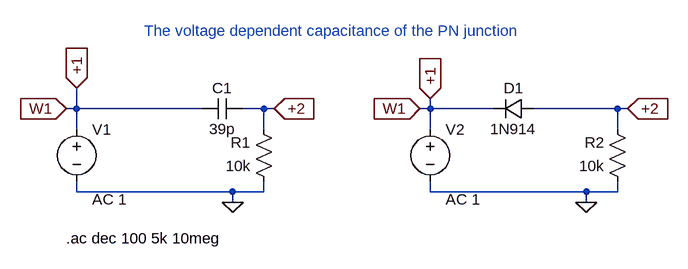
[diagram p0: schematic v_dep_pn_ltspice.asc]
v_dep_pn_ltspice.asc, the LTspice schematic file:
Version 4
SHEET 1 880 680
WIRE -160 112 -160 80
WIRE -160 112 -176 112
WIRE 32 112 -160 112
WIRE 128 112 96 112
WIRE 144 112 128 112
WIRE 384 112 384 96
WIRE 384 112 368 112
WIRE 480 112 384 112
WIRE 672 112 544 112
WIRE 688 112 672 112
WIRE -160 144 -160 112
WIRE 128 144 128 112
WIRE 384 144 384 112
WIRE 672 144 672 112
WIRE -160 240 -160 224
WIRE 80 240 -160 240
WIRE 128 240 128 224
WIRE 128 240 80 240
WIRE 384 240 384 224
WIRE 624 240 384 240
WIRE 672 240 672 224
WIRE 672 240 624 240
WIRE 80 256 80 240
WIRE 624 256 624 240
FLAG 80 256 0
FLAG 624 256 0
FLAG -176 112 W1
IOPIN -176 112 In
FLAG 144 112 +2
IOPIN 144 112 In
FLAG -160 80 +1
IOPIN -160 80 In
FLAG 368 112 W1
IOPIN 368 112 In
FLAG 384 96 +1
IOPIN 384 96 In
FLAG 688 112 +2
IOPIN 688 112 In
SYMBOL res 144 240 R180
WINDOW 0 36 76 Left 2
WINDOW 3 36 40 Left 2
SYMATTR InstName R1
SYMATTR Value 10k
SYMBOL cap 96 96 R90
WINDOW 0 0 32 VBottom 2
WINDOW 3 32 32 VTop 2
SYMATTR InstName C1
SYMATTR Value 39p
SYMBOL voltage -160 128 R0
WINDOW 123 24 124 Left 2
WINDOW 39 0 0 Left 0
SYMATTR Value2 AC 1
SYMATTR InstName V1
SYMATTR Value ""
SYMBOL res 688 240 R180
WINDOW 0 36 76 Left 2
WINDOW 3 36 40 Left 2
SYMATTR InstName R2
SYMATTR Value 10k
SYMBOL voltage 384 128 R0
WINDOW 123 24 124 Left 2
WINDOW 39 0 0 Left 0
SYMATTR Value2 AC 1
SYMATTR InstName V2
SYMATTR Value ""
SYMBOL diode 544 96 R90
WINDOW 0 0 32 VBottom 2
WINDOW 3 32 32 VTop 2
SYMATTR InstName D1
SYMATTR Value 1N914
TEXT -176 312 Left 2 !.ac dec 100 5k 10meg
TEXT -56 -8 Left 2 ;The voltage dependent capacitance of the PN junction

The netlist it stands for:
* v_dep_pn_ltspice.asc
R1 0 +2 10k
C1 +2 +1 39p
V1 +1 0 AC 1
R2 0 +2 10k
V2 +1 0 AC 1
D1 +2 +1 1N914
.model D D
.lib standard.dio
.ac dec 100 5k 10meg
* The voltage dependent capacitance of the PN junction
.backanno
.end